# Altium schematic sheet Mezclador2.SchDoc
size A4
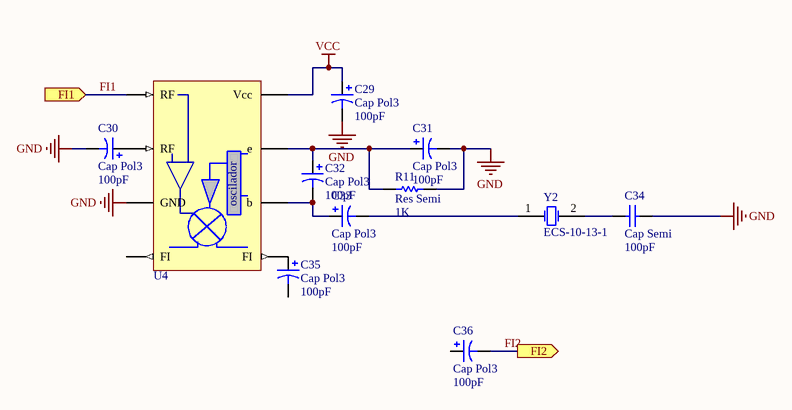
[diagram p0: Mezclador2.SchDoc]

## Parts
C29  Cap Pol3  value 100pF  [C0805]
C30  Cap Pol3  value 100pF  [C0805]
C31  Cap Pol3  value 100pF  [C0805]
C32  Cap Pol3  value 100pF  [C0805]
C33  Cap Pol3  value 100pF  [C0805]
C34  Cap Semi  value 100pF  [C1206]
C35  Cap Pol3  value 100pF  [C0805]
C36  Cap Pol3  value 100pF  [C0805]
R11  Res Semi  value 1K  [2012[0805]]
U4  SA602  [SA602]  (value not drawn)
Y2  ECS-10-13-1  [HC-49U]

## Ports
FI1 (in), FI2 (out)

## Nets
GND: C29.2 C30.2 C31.2 C34.2 R11.1 U4.3(GND)
VCC: C29.1 U4.8(Vcc)
FI1: U4.1(RF) ; port FI1
FI2: C36.2 ; port FI2
NetC30_1: C30.1 U4.2(RF)
NetC31_1: C31.1 C32.1 R11.2 U4.7(e)
NetC32_2: C32.2 C33.1 U4.6(b)
NetC33_2: C33.2 Y2.1(OSC1)
NetC34_1: C34.1 Y2.2(OSC2)
NetC35_1: C35.1 U4.5(FI)

Not connected (* = marked no-connect by the designer): C35 2; C36 1; U4 4(FI)

## Notes on the sheet
- (in symbol SA602A) oscilador

## Library data of the parts
C29-C33 C35 C36 = Cap Pol3: Polarized Capacitor (Surface Mount); Published: 8-Jun-2000; LatestRevisionDate: 17-Jul-2002; LatestRevisionNote: Re-released for DXP Platform.; PackageReference: C0805; Publisher: Altium Limited
C34 = Cap Semi: Capacitor (Semiconductor SIM Model); Published: 8-Jun-2000; LatestRevisionDate: 17-Jul-2002; LatestRevisionNote: Re-released for DXP Platform.; PackageReference: C1206; Publisher: Altium Limited
R11 = Res Semi: Semiconductor Resistor; Published: 8-Jun-2000; LatestRevisionDate: 17-Jul-2002; LatestRevisionNote: Re-released for DXP Platform.; PackageReference: AXIAL-0.5; Publisher: Altium Limited
U4 = SA602A: Mezclador 500MHz
Y2 = ECS-10-13-1: Crystal Oscillator; Published: 17-Jul-2002; DatasheetDocument: 18-Apr-2000; PackageReference: HC-49U; Publisher: Altium Limited; ComponentLink1Description: Manufacturer Link; ComponentLink1URL: http://www.ecsxtal.com/; ComponentLink2Description: Datasheet; ComponentLink2URL: http://www.ecsxtal.com/pdf2/HC49U.PDF